# Altium schematic sheet DAC-Bessel-LPF.SchDoc: Bessel LPF (4MHz / 0dB)
size A4; Date: 27.09.2023; ApprovedBy: M.Sc. Tobias Wirth; CheckedBy: M.Sc. Tobias Wirth; Author: M.Sc. Tobias Wirth; CompanyName: University of Stuttgart; DrawnBy: M.Sc. Tobias Wirth; Engineer: M.Sc. Tobias Wirth; Organization: IIS; Address1: Pfaffenwaldring 47; Address2: 70569 Stuttgart; Revision: V1.1; SheetNumber: 8; SheetTotal: 17; ProjectNameAlt: AUS - NMR System; Time: 19:10; ImagePath: N/A; Application_BuildNumber: N/A
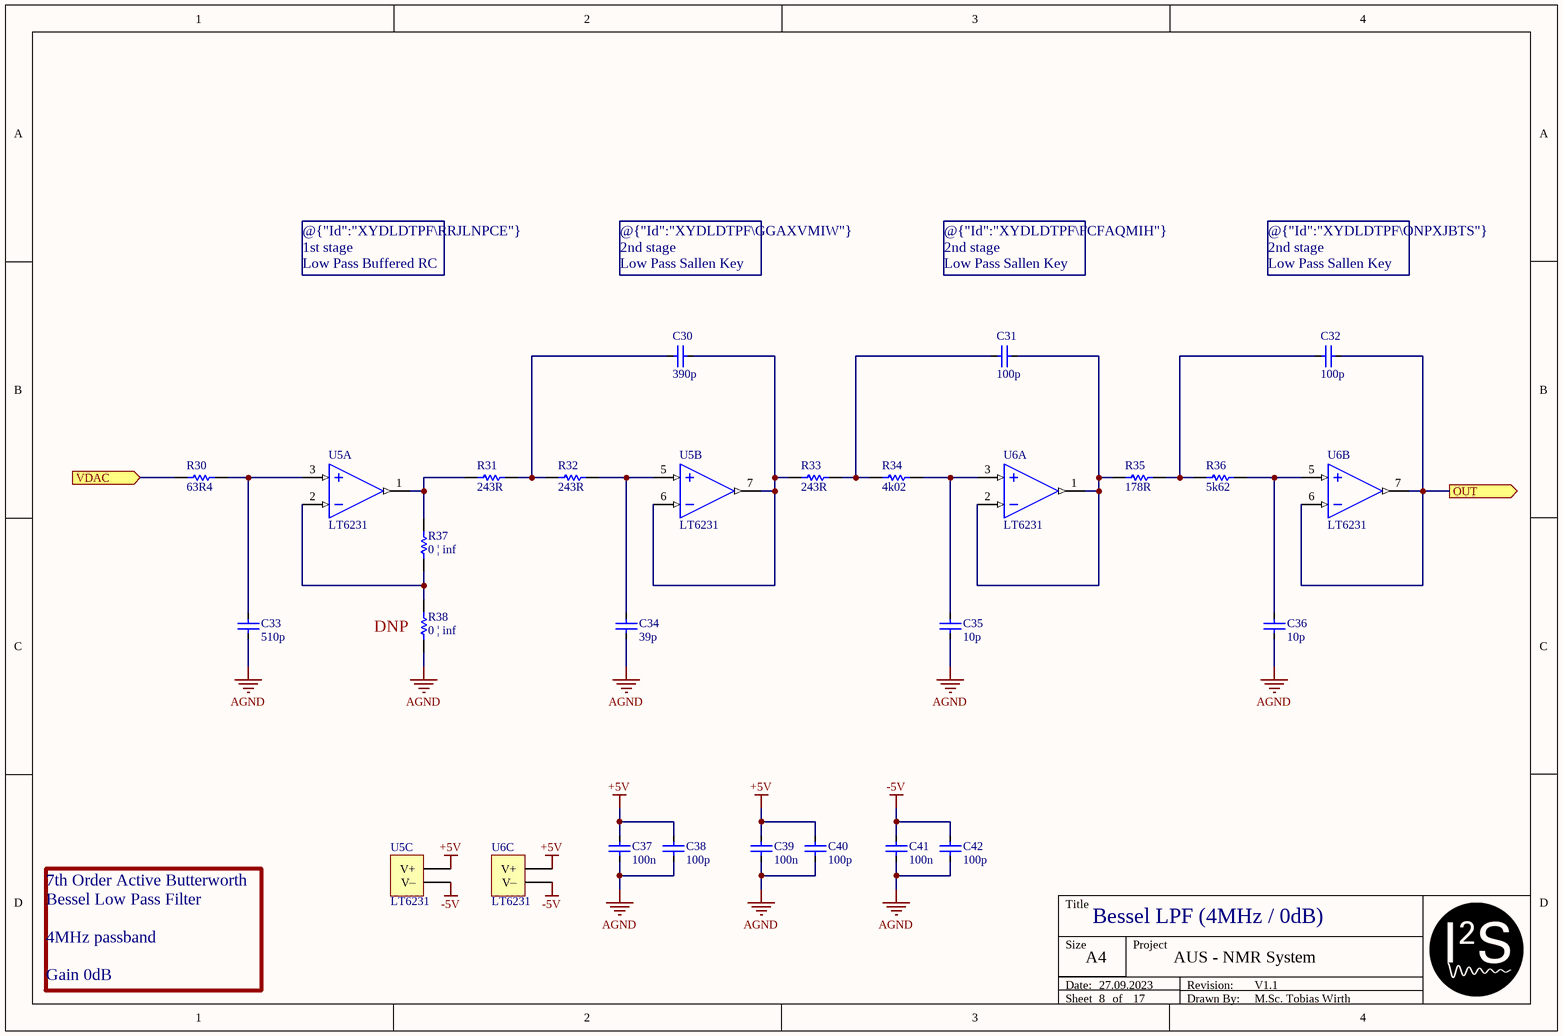
[diagram p0: DAC-Bessel-LPF.SchDoc]

## Parts
C30  390p  [CAP_0402]
C31  100p  [CAP_0402]
C32  100p  [CAP_0402]
C33  510p  [CAP_0402]
C34  39p  [CAP_0402]
C35  10p  [CAP_0402]
C36  10p  [CAP_0402]
C37  100n  [CAP_0402]
C38  100p  [CAP_0402]
C39  100n  [CAP_0402]
C40  100p  [CAP_0402]
C41  100n  [CAP_0402]
C42  100p  [CAP_0402]
R30  63R4  [RES_0402]
R31  243R  [RES_0402]
R32  243R  [RES_0402]
R33  243R  [RES_0402]
R34  4k02  [RES_0402]
R35  178R  [RES_0402]
R36  5k62  [RES_0402]
R37  0 | inf  [RES_0402]
R38  0 | inf  [RES_0402]
U5  LT6231  [SOP127P600X175-8N]  (parts A,B,C of 3)
U6  LT6231  [SOP127P600X175-8N]  (parts A,B,C of 3)

## Ports
OUT (out), VDAC (in)

## Nets
+5V: C37.1 C38.1 C39.1 C40.1 U5.8(V+) U6.8(V+)
-5V: C41.1 C42.1 U5.4(V–) U6.4(V–)
AGND: C33.2 C34.2 C35.2 C36.2 C37.2 C38.2 C39.2 C40.2 C41.2 C42.2 R38.1
OUT: C32.2 U6.6(IN1-) U6.7(OUT2) ; port OUT
VDAC: R30.1 ; port VDAC
NetC30_1: C30.1 R31.2 R32.1
NetC30_2: C30.2 R33.1 U5.6(IN1-) U5.7(OUT2)
NetC31_1: C31.1 R33.2 R34.1
NetC31_2: C31.2 R35.1 U6.1(OUT1) U6.2(IN1-)
NetC32_1: C32.1 R35.2 R36.1
NetC33_1: C33.1 R30.2 U5.3(IN1+)
NetC34_1: C34.1 R32.2 U5.5(IN1+)
NetC35_1: C35.1 R34.2 U6.3(IN1+)
NetC36_1: C36.1 R36.2 U6.5(IN1+)
NetR31_1: R31.1 R37.2 U5.1(OUT1)
NetR37_1: R37.1 R38.2 U5.2(IN1-)

## Notes on the sheet
- @{"Id":"XYDLDTPF\RRJLNPCE"}
  1st stage
  Low Pass Buffered RC
- @{"Id":"XYDLDTPF\GGAXVMIW"}
  2nd stage
  Low Pass Sallen Key
- @{"Id":"XYDLDTPF\FCFAQMIH"}
  2nd stage
  Low Pass Sallen Key
- @{"Id":"XYDLDTPF\ONPXJBTS"}
  2nd stage
  Low Pass Sallen Key
- (near R38) DNP
- 7th Order Active Butterworth Bessel Low Pass Filter
  4MHz passband
  Gain 0dB
- Title
- Size
- Date:
- Sheet
- A4
- of
- Project
- Drawn By:
- Revision:

## Library data of the parts
C30-C42 = Cap: Supplier: *; Part Number: *
  C30: Value: 390p
  C31 C32 C38 C40 C42: Value: 100p
  C33: Value: 510p; Supplier 1: Digi-Key; Supplier Part Number 1: 490-GCM1555C1H511FA16DCT-ND
  C34: Value: 39p
  C35 C36: Value: 10p
  C37 C39 C41: Value: 100n
R30-R38 = Res: Part Number: *; Supplier: *
  R30: Value: 63R4; Supplier 1: Digi-Key; Supplier Part Number 1: RT0402FRE0763R4L-ND
  R31-R33: Value: 243R
  R34: Value: 4k02
  R35: Value: 178R
  R36: Value: 5k62
  R37 R38: Value: 0 | inf
U5 U6 = LT6231: 215MHz, Rail-to-Rail Output, 1.1nV/√Hz, 3.5mA Op Amp Family; Supplier 1: Mouser; Supplier Part Number 1: 584-LT6231IS8#PBF